# EAGLE design VSR Mini Mega rev 1.206C dual led option (EAGLE 9.6.2)
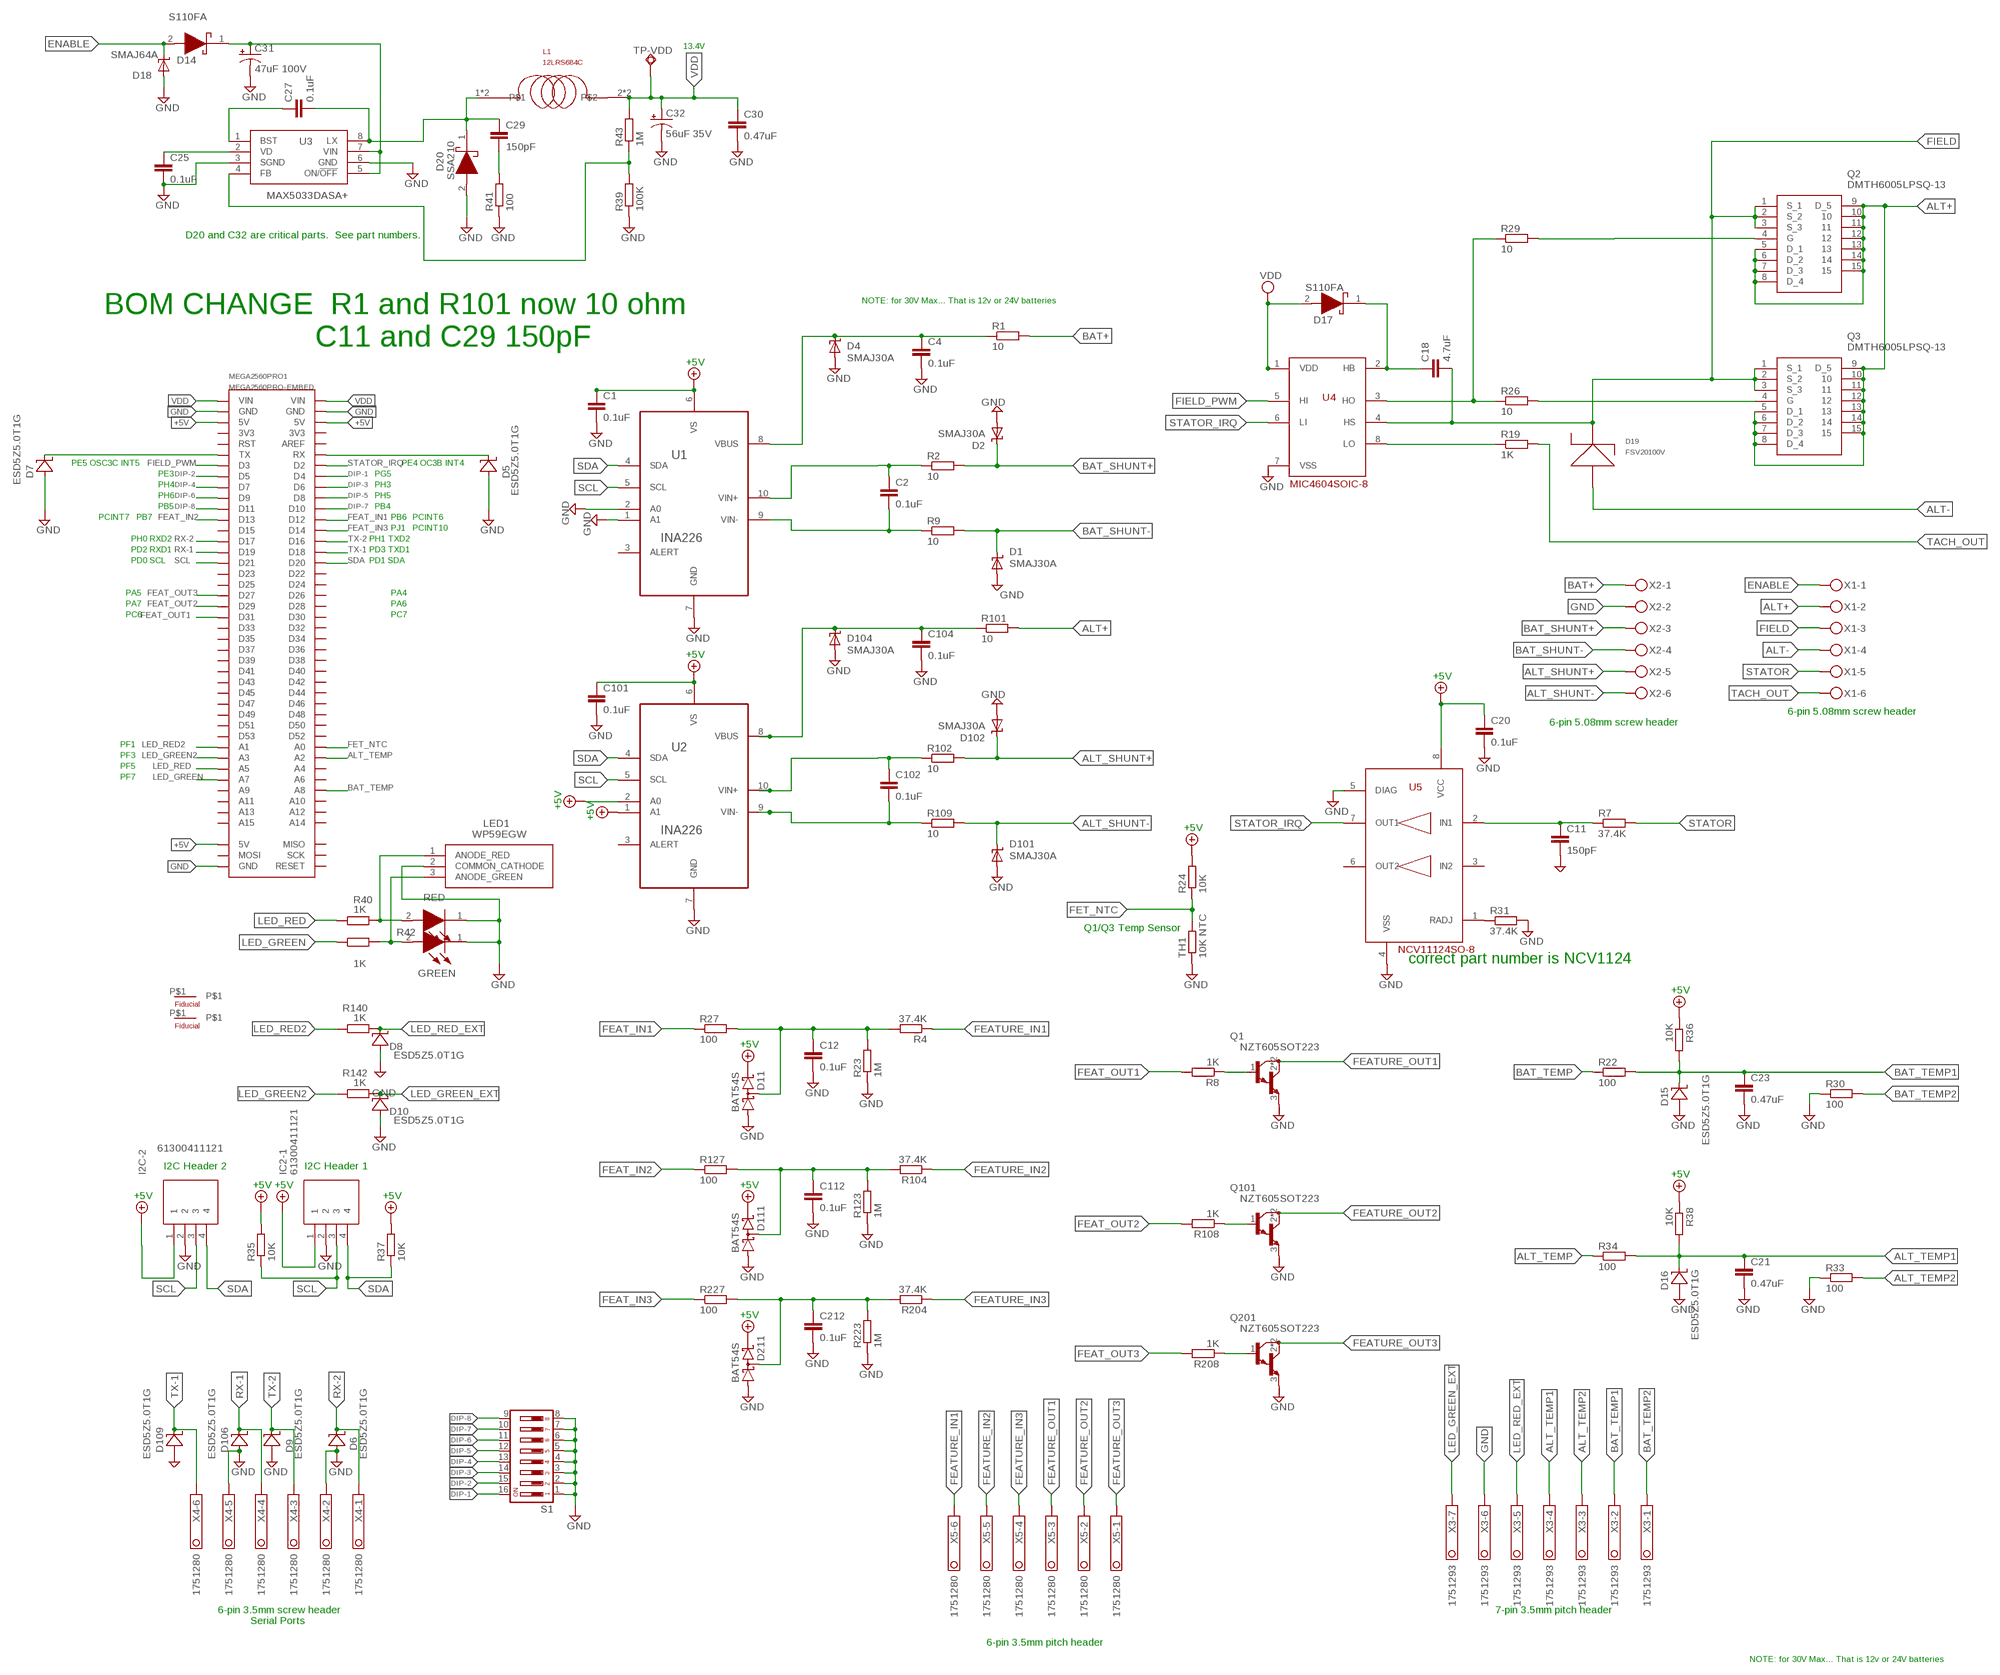
[diagram p0: schematic, sheet 1]

## Parts
C1  0.1uF  C-EUC0603  [C0603]
C2  0.1uF  C-EUC0603  [C0603]
C4  0.1uF  C-EUC0603  [C0603]
C11  150pF  C-EUC0603  [C0603]
C12  0.1uF  C-EUC0603  [C0603]
C18  4.7uF  C-EUC0603K  [C0603K]
C20  0.1uF  C-EUC0603  [C0603]
C21  0.47uF  C-EUC0603  [C0603]
C23  0.47uF  C-EUC0603  [C0603]
C25  0.1uF  C-EUC0603  [C0603]
C27  0.1uF  C-EUC0603  [C0603]
C29  150pF  C-EUC0603  [C0603]
C30  0.47uF  C-EUC0603  [C0603]
C31  47uF 100V  CPOL-USCAPPRD500W60D100H1250B  [CAPPRD500W60D1000H1250B]
C32  56uF 35V  CPOL-US  [CAPPRD250W50D630H1100B]
C101  0.1uF  C-EUC0603  [C0603]
C102  0.1uF  C-EUC0603  [C0603]
C104  0.1uF  C-EUC0603  [C0603]
C112  0.1uF  C-EUC0603  [C0603]
C212  0.1uF  C-EUC0603  [C0603]
D1  SMAJ30A  SUPPRESSOR-SMBJ  [SMBJ]
D2  SMAJ30A  SUPPRESSOR-SMBJ  [SMBJ]
D4  SMAJ30A  SUPPRESSOR-SMBJ  [SMBJ]
D5  ESD5Z5.0T1G  [SOD523]
D6  ESD5Z5.0T1G  [SOD523]
D7  ESD5Z5.0T1G  [SOD523]
D8  ESD5Z5.0T1G  [SOD523]
D9  ESD5Z5.0T1G  [SOD523]
D10  ESD5Z5.0T1G  [SOD523]
D11  BAT54S  [SOT23]
D14  S110FA  [SODFL3618X143N]
D15  ESD5Z5.0T1G  [SOD523]
D16  ESD5Z5.0T1G  [SOD523]
D17  S110FA  [SODFL3618X143N]
D18  SMAJ64A  SUPPRESSOR-SMBJ  [SMBJ]
D19  FSV20100V  [TO-277]
D20  SSA210  [DIOM5227X270N]
D101  SMAJ30A  SUPPRESSOR-SMBJ  [SMBJ]
D102  SMAJ30A  SUPPRESSOR-SMBJ  [SMBJ]
D104  SMAJ30A  SUPPRESSOR-SMBJ  [SMBJ]
D106  ESD5Z5.0T1G  [SOD523]
D109  ESD5Z5.0T1G  [SOD523]
D111  BAT54S  [SOT23]
D211  BAT54S  [SOT23]
FIDUCIAL1  FIDUCIAL060  [FIDUCIAL060]
FIDUCIAL2  FIDUCIAL060  [FIDUCIAL060]
GREEN  599-0110-007F  [LEDM2012X90N]
I2C-2  61300411121  [HDRV4W95P0X254_1X4_1016X254X85]
IC2-1  61300411121  [HDRV4W95P0X254_1X4_1016X254X85]
L1  12LRS684C  [IND_12LRS156C]
LED1  WP59EGW  [T-1_3/4(5MM)_BI-COLOR_INDICATO]
MEGA2560PRO1  MEGA2560PRO-EMBED  [MEGA2560PRO-EMBED]
Q1  NZT605SOT223  [SOT223]
Q2  DMTH6005LPSQ-13  [DMTH6005LPSQ13]
Q3  DMTH6005LPSQ-13  [DMTH6005LPSQ13]
Q101  NZT605SOT223  [SOT223]
Q201  NZT605SOT223  [SOT223]
R1  10  R-EU_R0603  [R0603]
R2  10  R-EU_R0603  [R0603]
R4  37.4K  R-EU_R0603  [R0603]
R7  37.4K  R-EU_R0603  [R0603]
R8  1K  R-EU_R0603  [R0603]
R9  10  R-EU_R0603  [R0603]
R19  1K  R-EU_R0603  [R0603]
R22  100  R-EU_R0603  [R0603]
R23  1M  R-EU_R0603  [R0603]
R24  10K  R-EU_R0603  [R0603]
R26  10  R-EU_R0603  [R0603]
R27  100  R-EU_R0603  [R0603]
R29  10  R-EU_R0603  [R0603]
R30  100  R-EU_R0603  [R0603]
R31  37.4K  R-EU_R0603  [R0603]
R33  100  R-EU_R0603  [R0603]
R34  100  R-EU_R0603  [R0603]
R35  10K  R-EU_R0603  [R0603]
R36  10K  R-EU_R0603  [R0603]
R37  10K  R-EU_R0603  [R0603]
R38  10K  R-EU_R0603  [R0603]
R39  100K  R-EU_R0603  [R0603]
R40  1K  R-EU_R0603  [R0603]
R41  100  R-EU_R0603  [R0603]
R42  1K  R-EU_R0603  [R0603]
R43  1M  R-EU_R0603  [R0603]
R101  10  R-EU_R0603  [R0603]
R102  10  R-EU_R0603  [R0603]
R104  37.4K  R-EU_R0603  [R0603]
R108  1K  R-EU_R0603  [R0603]
R109  10  R-EU_R0603  [R0603]
R123  1M  R-EU_R0603  [R0603]
R127  100  R-EU_R0603  [R0603]
R140  1K  R-EU_R0603  [R0603]
R142  1K  R-EU_R0603  [R0603]
R204  37.4K  R-EU_R0603  [R0603]
R208  1K  R-EU_R0603  [R0603]
R223  1M  R-EU_R0603  [R0603]
R227  100  R-EU_R0603  [R0603]
RED  599-0110-007F  [LEDM2012X90N]
S1  DP08  [DP-08]
TH1  10K NTC  R-EU_R0402  [R0402]
TP-VDD  TPSQTP20SQ  [TP20SQ]
U1  INA226  [SOP50P490X110-10N]
U2  INA226  [SOP50P490X110-10N]
U3  MAX5033DASA+  [SOIC127P600X175-8N]
U4  MIC4604SOIC-8  [SOIC8]
U5  NCV11124SO-8  [SO-8]
X1  MKDSN1,5/6-5,08  [MKDSN1,5/6-5,08]
X2  MKDSN1,5/6-5,08  [MKDSN1,5/6-5,08]
X3  1751293  [1751293]
X4  1751280  [1751280]
X5  1751280  [1751280]

## Nets
+5V: C1.1 C20.1 C101.1 D11.2(C2) D111.2(C2) D211.2(C2) I2C-2.1 IC2-1.1 MEGA2560PRO1.5V@1(5V) MEGA2560PRO1.5V@2(5V) MEGA2560PRO1.5V@3(5V) R24.2 R35.2 R36.1 R37.2 R38.1 U1.6(VS) U2.1(A1) U2.2(A0) U2.6(VS) U5.8(VCC)
ALT+: Q2.5(D_1) Q2.6(D_2) Q2.7(D_3) Q2.8(D_4) Q2.9(D_5) Q2.10 Q2.11 Q2.12 Q2.13 Q2.14 Q2.15 Q3.5(D_1) Q3.6(D_2) Q3.7(D_3) Q3.8(D_4) Q3.9(D_5) Q3.10 Q3.11 Q3.12 Q3.13 Q3.14 Q3.15 R101.2 X1.2
ALT-: D19.1 D19.2 X1.4
ALT_SHUNT+: D102.C R102.2 X2.5
ALT_SHUNT-: D101.C R109.2 X2.6
ALT_TEMP: MEGA2560PRO1.A2 R34.1
ALT_TEMP1: C21.1 D16.C R34.2 R38.2 X3.4
ALT_TEMP2: R33.2 X3.3
BAT+: R1.2 X2.1
BAT_SHUNT+: D2.C R2.2 X2.3
BAT_SHUNT-: D1.C R9.2 X2.4
BAT_TEMP: MEGA2560PRO1.A8 R22.1
BAT_TEMP1: C23.1 D15.C R22.2 R36.2 X3.2
BAT_TEMP2: R30.2 X3.1
D111: C112.1 D111.3(C1A2) R104.2 R123.2 R127.2
DIP-1: MEGA2560PRO1.D4 S1.16
DIP-2: MEGA2560PRO1.D5 S1.15
DIP-3: MEGA2560PRO1.D6 S1.14
DIP-4: MEGA2560PRO1.D7 S1.13
DIP-5: MEGA2560PRO1.D8 S1.12
DIP-6: MEGA2560PRO1.D9 S1.11
DIP-7: MEGA2560PRO1.D10 S1.10
DIP-8: MEGA2560PRO1.D11 S1.9
ENABLE: D14.2(A) D18.C X1.1
FEAT_IN1: MEGA2560PRO1.D12 R27.1
FEAT_IN2: MEGA2560PRO1.D13 R127.1
FEAT_IN3: MEGA2560PRO1.D14 R227.1
FEAT_OUT1: MEGA2560PRO1.D31 R8.2
FEAT_OUT2: MEGA2560PRO1.D29 R108.2
FEAT_OUT3: MEGA2560PRO1.D27 R208.2
FEATURE_IN1: R4.1 X5.6
FEATURE_IN2: R104.1 X5.5
FEATURE_IN3: R204.1 X5.4
FEATURE_OUT1: Q1.2(C) Q1.4(C) X5.3
FEATURE_OUT2: Q101.2(C) Q101.4(C) X5.2
FEATURE_OUT3: Q201.2(C) Q201.4(C) X5.1
FET_NTC: MEGA2560PRO1.A0 R24.1 TH1.2
FIELD: C18.2 D19.3 Q2.1(S_1) Q2.2(S_2) Q2.3(S_3) Q3.1(S_1) Q3.2(S_2) Q3.3(S_3) U4.4(HS) X1.3
FIELD_PWM: MEGA2560PRO1.D3 U4.5(HI)
GND: C1.2 C4.2 C11.2 C12.2 C20.2 C21.2 C23.2 C25.2 C30.2 C31.2(-) C32.2(-) C101.2 C104.2 C112.2 C212.2 D1.A D2.A D4.A D5.A D6.A D7.A D8.A D9.A D10.A D11.1(A1) D15.A D16.A D18.A D20.2(A) D101.A D102.A D104.A D106.A D109.A D111.1(A1) D211.1(A1) GREEN.1(K) I2C-2.2 IC2-1.2 LED1.2(COMMON_CATHODE) MEGA2560PRO1.GND@1(GND) MEGA2560PRO1.GND@2(GND) MEGA2560PRO1.GND@3(GND) Q1.3(E) Q101.3(E) Q201.3(E) R23.1 R30.1 R31.2 R33.1 R39.1 R41.1 R123.1 R223.1 RED.1(K) S1.1 S1.2 S1.3 S1.4 S1.5 S1.6 S1.7 S1.8 TH1.1 U1.1(A1) U1.2(A0) U1.7(GND) U2.7(GND) U3.3(SGND) U3.6(GND) U4.7(VSS) U5.4(VSS) U5.5(DIAG) X2.2 X3.6 X4.2 X4.5
LED_GREEN: MEGA2560PRO1.A7 R42.1
LED_GREEN2: MEGA2560PRO1.A3 R142.1
LED_GREEN_EXT: D10.C R142.2 X3.7
LED_RED: MEGA2560PRO1.A5 R40.1
LED_RED2: MEGA2560PRO1.A1 R140.1
LED_RED_EXT: D8.C R140.2 X3.5
N$1: C102.1 R102.1 U2.10(VIN+)
N$2: C102.2 R109.1 U2.9(VIN-)
N$3: C2.1 R2.1 U1.10(VIN+)
N$4: C2.2 R9.1 U1.9(VIN-)
N$5: C104.1 D104.C R101.1 U2.8(VBUS)
N$6: C18.1 D17.1(K) U4.2(HB)
N$7: C12.1 D11.3(C1A2) R4.2 R23.2 R27.2
N$8: R26.1 R29.1 U4.3(HO)
N$9: C212.1 D211.3(C1A2) R204.2 R223.2 R227.2
N$10: Q1.1(B) R8.1
N$11: Q2.4(G) R29.2
N$12: R19.1 U4.8(LO)
N$13: Q3.4(G) R26.2
N$14: C11.1 R7.1 U5.2(IN1)
N$15: R31.1 U5.1(RADJ)
N$16: Q101.1(B) R108.1
N$17: C4.1 D4.C R1.1 U1.8(VBUS)
N$18: Q201.1(B) R208.1
N$19: C31.1(+) D14.1(K) U3.5(ON/!OFF) U3.7(VIN)
N$20: C25.1 U3.2(VD)
N$21: C27.1 U3.1(BST)
N$22: C27.2 C29.1 D20.1(K) L1.1 L1.4 U3.8(LX)
N$23: D7.C MEGA2560PRO1.TX
N$24: C29.2 R41.2
N$25: LED1.1(ANODE_RED) R40.2 RED.2(A)
N$26: GREEN.2(A) LED1.3(ANODE_GREEN) R42.2
N$27: R39.2 R43.1 U3.4(FB)
N$28: D5.C MEGA2560PRO1.RX
RX-1: D106.C MEGA2560PRO1.D19 X4.4
RX-2: D6.C MEGA2560PRO1.D17 X4.1
SCL: I2C-2.3 IC2-1.3 MEGA2560PRO1.D21 R35.1 U1.5(SCL) U2.5(SCL)
SDA: I2C-2.4 IC2-1.4 MEGA2560PRO1.D20 R37.1 U1.4(SDA) U2.4(SDA)
STATOR: R7.2 X1.5
STATOR_IRQ: MEGA2560PRO1.D2 U4.6(LI) U5.7(OUT1)
TACH_OUT: R19.2 X1.6
TX-1: D109.C MEGA2560PRO1.D18 X4.6
TX-2: D9.C MEGA2560PRO1.D16 X4.3
VDD: C30.1 C32.1(+) D17.2(A) L1.2 L1.3 MEGA2560PRO1.VIN@1(VIN) MEGA2560PRO1.VIN@2(VIN) R43.2 TP-VDD.TP U4.1(VDD)
Unconnected: FIDUCIAL1.P$1 FIDUCIAL2.P$1 MEGA2560PRO1.3V3@1(3V3) MEGA2560PRO1.3V3@2(3V3) MEGA2560PRO1.A4 MEGA2560PRO1.A6 MEGA2560PRO1.A9 MEGA2560PRO1.A10 MEGA2560PRO1.A11 MEGA2560PRO1.A12 MEGA2560PRO1.A13 MEGA2560PRO1.A14 MEGA2560PRO1.A15 MEGA2560PRO1.AREF MEGA2560PRO1.D15 MEGA2560PRO1.D22 MEGA2560PRO1.D23 MEGA2560PRO1.D24 MEGA2560PRO1.D25 MEGA2560PRO1.D26 MEGA2560PRO1.D28 MEGA2560PRO1.D30 MEGA2560PRO1.D32 MEGA2560PRO1.D33 MEGA2560PRO1.D34 MEGA2560PRO1.D35 MEGA2560PRO1.D36 MEGA2560PRO1.D37 MEGA2560PRO1.D38 MEGA2560PRO1.D39 MEGA2560PRO1.D40 MEGA2560PRO1.D41 MEGA2560PRO1.D42 MEGA2560PRO1.D43 MEGA2560PRO1.D44 MEGA2560PRO1.D45 MEGA2560PRO1.D46 MEGA2560PRO1.D47 MEGA2560PRO1.D48 MEGA2560PRO1.D49 MEGA2560PRO1.D50 MEGA2560PRO1.D51 MEGA2560PRO1.D52 MEGA2560PRO1.D53 MEGA2560PRO1.MISO MEGA2560PRO1.MOSI MEGA2560PRO1.RESET MEGA2560PRO1.RST MEGA2560PRO1.SCK U1.3(ALERT) U2.3(ALERT) U5.3(IN2) U5.6(OUT2)

## Notes on the sheet
- 13.4V
- D20 and C32 are critical parts.  See part numbers.
- NOTE: for 30V Max... That is 12v or 24V batteries
- BOM CHANGE  R1 and R101 now 10 ohm
- C11 and C29 150pF
- PE5 OSC3C INT5 | PE4 OC3B INT4
- PE3 | PG5
- PH4 | PH3
- PH6 | PH5
- PB5 | PB4
- PCINT7 | PB7 | PB6 | PCINT6
- PJ1 | PCINT10
- PH0 RXD2 | PH1 TXD2
- PD2 RXD1 | PD3 TXD1
- PD0 SCL | PD1 SDA
- PA5 | PA4
- PA7 | PA6
- PC6 | PC7
- 6-pin 5.08mm screw header
- 6-pin 5.08mm screw header
- PF1
- PF3
- PF5
- PF7
- Q1/Q3 Temp Sensor
- correct part number is NCV1124
- I2C Header 2 | I2C Header 1
- 6-pin 3.5mm screw header | 7-pin 3.5mm pitch header
- Serial Ports
- 6-pin 3.5mm pitch header
- NOTE: for 30V Max... That is 12v or 24V batteries

## Library data of the parts
C1 C2 C4 C11 C12 C18 C20 C21 C23 C25 C27 C29 C30 C101 C102 C104 C112 C212 = rcl:C-EU: CAPACITOR, European symbol; SPICEPREFIX: C
C31 C32 = DublerCustomParts:CPOL-US: POLARIZED CAPACITOR, American symbol
D1 D2 D4 D18 D101 D102 D104 = diode:SUPPRESSOR-: Suppressor diode
D5-D10 D15 D16 D106 D109 = DublerCustomParts:ESD5Z5.0T1G
D11 D111 D211 = diode:BAT54S: Schottky Diodes Pin connection corrected 2011-05-04 Source: Fairchild .. BAT54.pdf
D14 D17 = SamacSys_Parts:S110FA: Schottky Diodes & Rectifiers 100V 1A Schottky Barrier Rectifier Source: Datasheet <https://componentsearchengine.com/Datasheets/1/S110FA.pdf>; DESCRIPTION: Schottky Diodes & Rectifiers 100V 1A Schottky Barrier Rectifier; HEIGHT: 1.43mm; MANUFACTURER_NAME: ON Semiconductor; MANUFACTURER_PART_NUMBER: S110FA; MOUSER_PART_NUMBER: 512-S110FA; MOUSER_PRICE-STOCK: https://www.mouser.com/Search/Refine.aspx?Keyword=512-S110FA
D19 = DublerCustomParts:FSV20100V: Diode Schottky 100V 20A Surface Mount TO-277-3 Check prices <https://pricing.snapeda.com/parts/FSV20100V/ON%20Semiconductor/view-part?ref=eda>; AVAILABILITY: Good; DESCRIPTION: Diode Schottky 100V 20A Surface Mount TO-277-3; MF: ON Semiconductor; MP: FSV20100V; PACKAGE: TO-277-3 ON Semiconductor; PRICE: None; PURCHASE-URL: https://pricing.snapeda.com/search/part/FSV20100V/?ref=eda
D20 = SamacSys_Parts:SSA210: Diode Schottky 100V 2A 2-Pin SMA T/R Source: Datasheet <https://www.onsemi.com/pub/Collateral/SSA210-D.pdf>; DESCRIPTION: Diode Schottky 100V 2A 2-Pin SMA T/R; HEIGHT: 2.7mm; MANUFACTURER_NAME: ON Semiconductor; MANUFACTURER_PART_NUMBER: SSA210; MOUSER_PART_NUMBER: 512-SSA210; MOUSER_PRICE-STOCK: https://www.mouser.co.uk/ProductDetail/ON-Semiconductor-Fairchild/SSA210/?qs=tqW9UTzndZw5aU%2F0PcUcNQ%3D%3D
FIDUCIAL1 FIDUCIAL2 = pads:FIDUCIAL060
GREEN RED = SamacSys_Parts:599-0110-007F: Standard LEDs - SMD SMD 0805 RED Source: Datasheet; DESCRIPTION: Standard LEDs - SMD SMD 0805 RED; HEIGHT: 0.9mm; MANUFACTURER_NAME: Dialight; MANUFACTURER_PART_NUMBER: 599-0110-007F; MOUSER_PART_NUMBER: 645-599-0110-007F; MOUSER_PRICE-STOCK: https://www.mouser.co.uk/ProductDetail/Dialight/599-0110-007F?qs=gTYE2QTfZfS0HtheKY0LlQ%3D%3D
I2C-2 IC2-1 = SamacSys_Parts:61300411121: WR-PHD 2.54mm Pin Header THT Straight 4p Wurth Elektronik WR-PHD Series, Series Number 6130, 2.54mm Pitch 4 Way 1 Row Straight PCB Header, Solder Termination Source: Datasheet <http://katalog.we-online.de/em/datasheet/6130xx11121.pdf>; DESCRIPTION: WR-PHD 2.54mm Pin Header THT Straight 4p Wurth Elektronik WR-PHD Series, Series Number 6130, 2.54mm Pitch 4 Way 1 Row Straight PCB Header, Solder Termination; HEIGHT: 8.54mm; MANUFACTURER_NAME: Wurth Elektronik; MANUFACTURER_PART_NUMBER: 61300411121; MOUSER_PART_NUMBER: 710-61300411121; MOUSER_PRICE-STOCK: https://www.mouser.co.uk/ProductDetail/Wurth-Elektronik/61300411121/?qs=PhR8RmCirEYQcLLqXD8rAA%3D%3D
L1 = DublerCustomParts:12LRS684C
LED1 = SamacSys_Parts:WP59EGW: 5MM BI-COLOR RED/GRN LED LAMP THOLE BULK Kingbright WP59EGW, WP Series Green, Red LED, 568 / 617 nm 3-Pin 5mm (T-1 3/4) Diffused, Dome Lens Through Hole package Source: Datasheet <http://www.us.kingbright.com/images/catalog/SPEC/WP59EGW.pdf>; DESCRIPTION: 5MM BI-COLOR RED/GRN LED LAMP THOLE BULK Kingbright WP59EGW, WP Series Green, Red LED, 568 / 617 nm 3-Pin 5mm (T-1 3/4) Diffused, Dome Lens Through Hole package; HEIGHT: mm; MANUFACTURER_NAME: Kingbright; MANUFACTURER_PART_NUMBER: WP59EGW; MOUSER_PART_NUMBER: 604-WP59EGW; MOUSER_PRICE-STOCK: https://www.mouser.co.uk/ProductDetail/Kingbright/WP59EGW/?qs=7T7YwZBtMHSEJxkhdk2k2w%3D%3D
MEGA2560PRO1 = MINI MEGA PRO EAGLE robotdyn:MEGA2560PRO-EMBED: Robotdyn Robotdyn Mega 2560 PRO (Embed) https://robotdyn.com/mega-2560-pro-embed-ch340g-atmega2560-16au.html
Q1 Q101 Q201 = DublerCustomParts:NZT605: NPN Darlington Transistor
Q2 Q3 = SamacSys_Parts:DMTH6005LPSQ-13: Trans MOSFET N-CH 60V 20.6A Automotive 8-Pin PowerDI 5060 T/R Source: Datasheet; DESCRIPTION: Trans MOSFET N-CH 60V 20.6A Automotive 8-Pin PowerDI 5060 T/R; HEIGHT: 2mm; MANUFACTURER_NAME: Diodes Inc.; MANUFACTURER_PART_NUMBER: DMTH6005LPSQ-13; MOUSER_PART_NUMBER: 621-DMTH6005LPSQ-13; MOUSER_PRICE-STOCK: https://www.mouser.co.uk/ProductDetail/Diodes-Incorporated/DMTH6005LPSQ-13?qs=icAhCOE9Tbg2WunJgzUq9Q%3D%3D
R1 R2 R4 R7-R9 R19 R22-R24 R26 R27 R29-R31 R33-R43 R101 R102 R104 R108 R109 R123 R127 R140 R142 R204 R208 R223 R227 TH1 = rcl:R-EU_: RESISTOR, European symbol; SPICEPREFIX: R
S1 = switch-dil:DP08: DIL/CODE SWITCH; MPN: DP08; OC_FARNELL: 9471626; OC_NEWARK: 73J0035
TP-VDD = testpad:TPSQ
U1 U2 = DublerCustomParts:INA226: CURRENT/POWER MONITOR with Two-Wire Interface; MOUSER: 595-INA226AIDGSR; MPN: INA226AIDGSR; PACKAGE: MSOP-10; SUPPLIER: Texas Instruments
U3 = SamacSys_Parts:MAX5033DASA+: DC-DC Converter Step Down 7.5V to 76V Source: Datasheet <http://datasheets.maximintegrated.com/en/ds/MAX5033.pdf>; DESCRIPTION: DC-DC Converter Step Down 7.5V to 76V; HEIGHT: 1.75mm; MANUFACTURER_NAME: Maxim Integrated; MANUFACTURER_PART_NUMBER: MAX5033DASA+; MOUSER_PART_NUMBER: 700-MAX5033DASA; MOUSER_PRICE-STOCK: https://www.mouser.com/Search/Refine.aspx?Keyword=700-MAX5033DASA
U4 = DublerCustomParts:MIC4604
U5 = DublerCustomParts:NCV11124
X1 X2 = con-phoenix-508:MKDSN1,5/6-5,08: MKDSN 1,5/ 6-5,08 Printklemme Nennstrom: 13,5 A Nennspannung: 250 V Rastermaß: 5,08 mm Polzahl: 6 Anschlussart: Schraubanschluss Montage: Löten Anschlussrichtung Leiter/Platine: 0 ° Artikelnummer: 1729160 Source: http://eshop.phoenixcontact.com .. 1729160.pdf
X3 = con-phoenix-350:1751293: MKDS 1/ 7-3,5 Printklemme Nennstrom: 10 A Bemessungsspannung: 160 V Raster: 3,5 mm Polzahl: 7 Montageart: Löten Anschlussart: Schraubanschluss Anschlussrichtung vom Leiter zur Platine: 0° Source: http://eshop.phoenixcontact.com .. 1751293.pdf; OC_FARNELL: unknown; OC_NEWARK: unknown
X4 X5 = con-phoenix-350:1751280: MKDS 1/ 6-3,5 Printklemme Nennstrom: 10 A Bemessungsspannung: 160 V Raster: 3,5 mm Polzahl: 6 Montageart: Löten Anschlussart: Schraubanschluss Anschlussrichtung vom Leiter zur Platine: 0° Source: http://eshop.phoenixcontact.com .. 1751280.pdf; MPN: 1751280; OC_FARNELL: unknown; OC_NEWARK: 27R1765

## Board
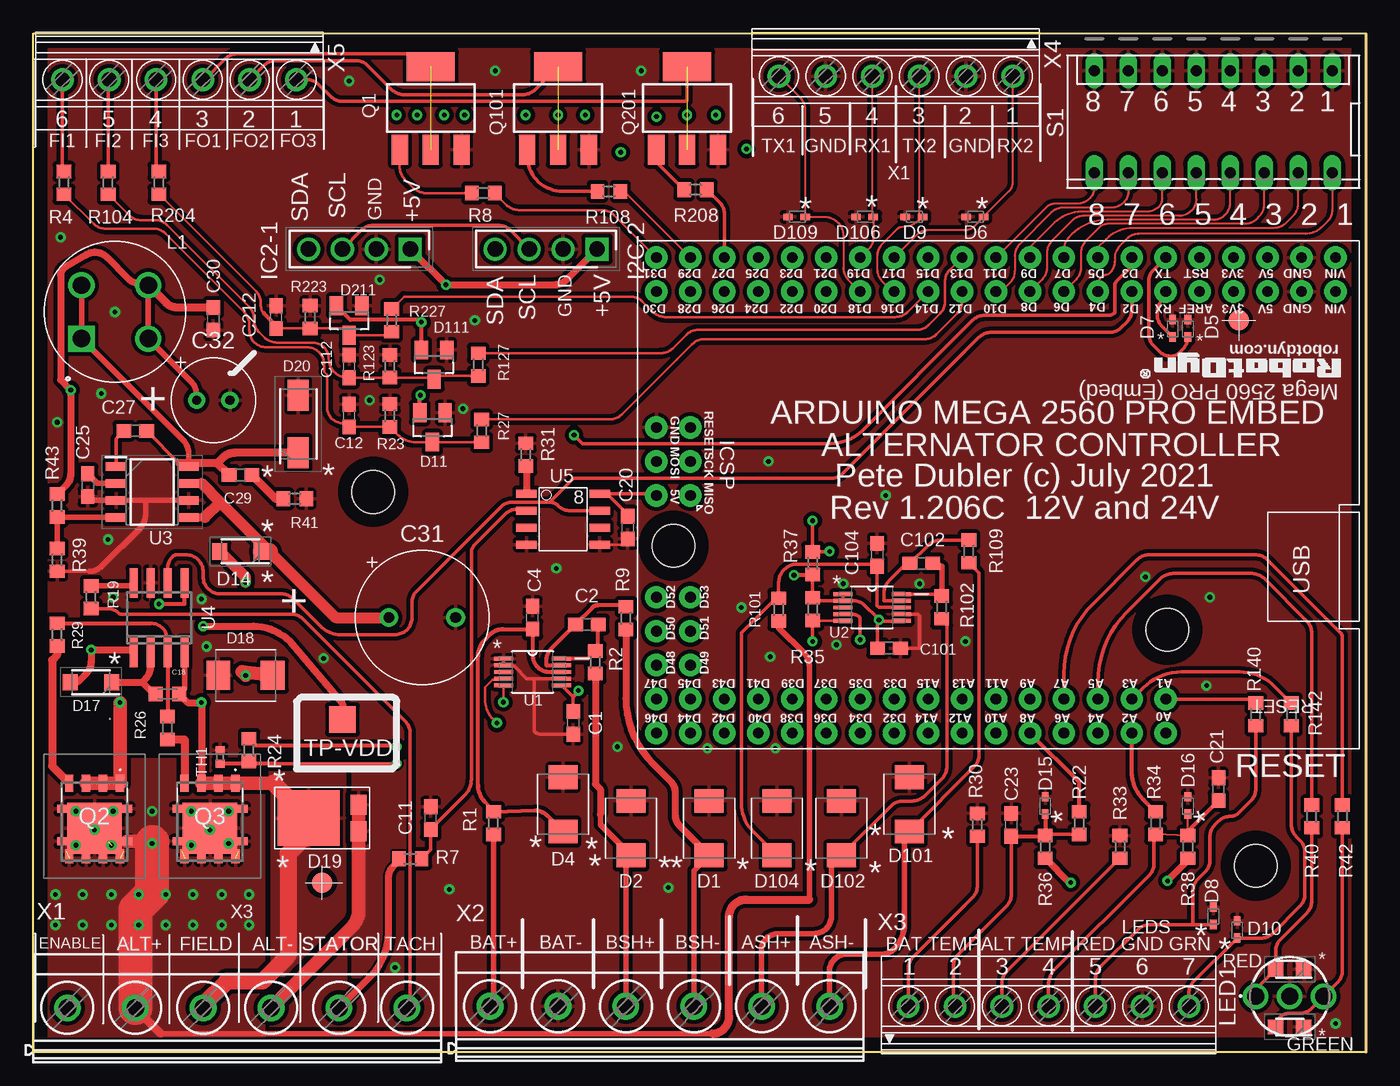
[diagram p1: board, top side]
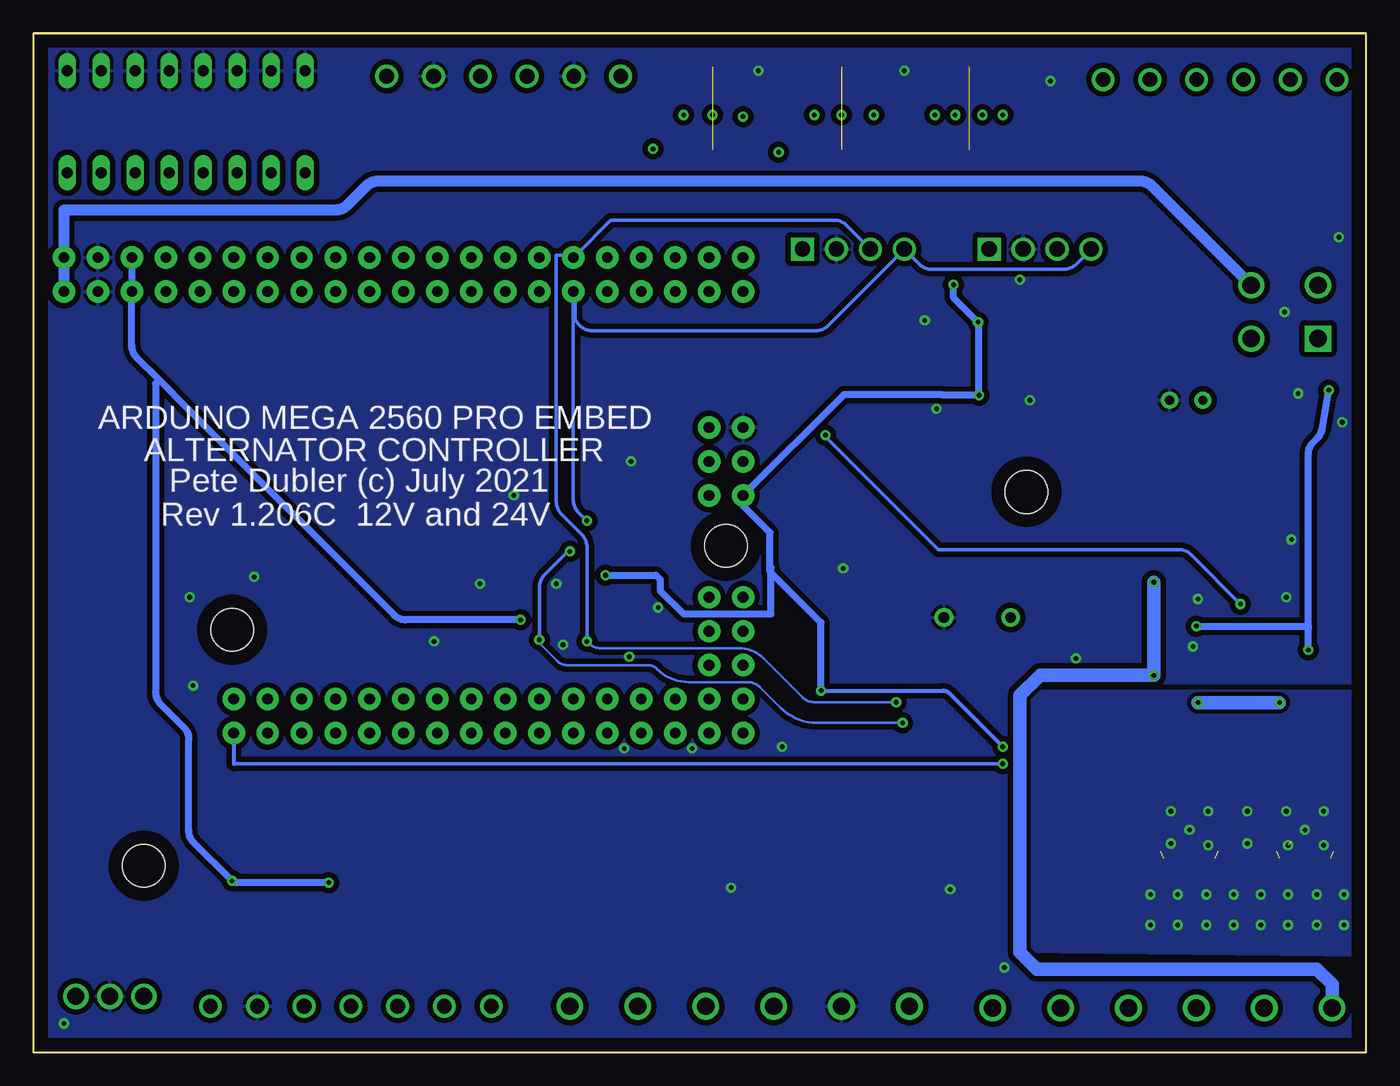
[diagram p2: board, bottom side, seen from below]

Size 99.69 x 76.2 mm. Coordinates in mm from the lower left corner, seen from the top.
Outline: 0,0 99.62,0 99.62,76.19 0,76.19
Outline: 0,0 0,76.2 99.69,76.2 99.69,0 0,0
Copper layers (1*16): Top 0.035mm / dielectric 1.5mm / Bottom 0.035mm
Design rules "default *": minimum track width 6mil, minimum drill 0.3mm, track to track 6mil, track to pad 6mil, pad to pad 6mil, via to via 6mil, smd to smd 6mil, copper to edge 40mil, drill to drill 6mil, minimum pad ring 10mil, minimum via ring 8mil, stop-mask expansion 4mil, vias tented up to drill 0mil, thermal gap 10mil
Holes 3.2 mm at 25.4,41.91 91.44,13.97

### Footprints (pad centres in the part's own frame; a part is rotated, then mirrored left to right if it is on the bottom)
C0603 = smd 1.1 x 1: 1 -0.85,0; 2 0.85,0
C0603K = smd 1.05 x 1.08: 1 -0.875,0; 2 0.875,0
CAPPRD500W60D1000H1250B = drill 0.8 pad 1.4: 1 -2.5,0; 2 2.5,0
CAPPRD250W50D630H1100B = drill 0.7 pad 1.3: 1 -1.25,0; 2 1.25,0
SMBJ = smd 1.78 x 2.16: A 2.04,0; C -2.03,0
SOD523 = smd 0.7 x 0.5: A 0.7,0; C -0.6,0
SOT23 = smd 1 x 1.4: 1 -0.95,-1.1; 2 0.95,-1.1; 3 0,1.1
SODFL3618X143N = smd 1.12 x 1.22: 1 -1.55,0; 2 1.55,0
TO-277 = smd 1.2 x 1.5: 1 2.75,0.985; 2 2.75,-0.985 | smd 4.65 x 4.15: 3 -1,0
DIOM5227X270N = smd 2.35 x 1.55: 1 -2.15,0; 2 2.15,0
FIDUCIAL060 = smd 1.524 x 1.524: P$1 0,0
LEDM2012X90N = smd 1.15 x 1.1: 1 -1.05,0; 2 1.05,0
HDRV4W95P0X254_1X4_1016X254X85 = drill 1.15 pad 1.725 square: 1 0,0 | drill 1.15 pad 1.725: 2 2.54,0; 3 5.08,0; 4 7.62,0
IND_12LRS156C = drill 1.3 square: 1 -2,2.5 | drill 1.3: 2 -2,-2.5; 3 2,-2.5; 4 2,2.5
T-1_3/4(5MM)_BI-COLOR_INDICATO = drill 1.26 pad 1.9: 1 0,2.54; 2 0,0; 3 0,-2.54
MEGA2560PRO-EMBED = drill 0.8 pad 1.676: 3V3@1 -25.4,-19.05; 3V3@2 -25.4,-16.51; 5V@1 -27.94,-19.05; 5V@2 -27.94,-16.51; 5V@3 17.78,-1.27; A0 -20.32,16.51; A1 -20.32,13.97; A2 -17.78,16.51; A3 -17.78,13.97; A4 -15.24,16.51; A5 -15.24,13.97; A6 -12.7,16.51; A7 -12.7,13.97; A8 -10.16,16.51; A9 -10.16,13.97; A10 -7.62,16.51; A11 -7.62,13.97; A12 -5.08,16.51; A13 -5.08,13.97; A14 -2.54,16.51; A15 -2.54,13.97; AREF -22.86,-16.51; D2 -17.78,-16.51; D3 -17.78,-19.05; D4 -15.24,-16.51; D5 -15.24,-19.05; D6 -12.7,-16.51; D7 -12.7,-19.05; D8 -10.16,-16.51; D9 -10.16,-19.05; D10 -7.62,-16.51; D11 -7.62,-19.05; D12 -5.08,-16.51; D13 -5.08,-19.05; D14 -2.54,-16.51; D15 -2.54,-19.05; D16 0,-16.51; D17 0,-19.05; D18 2.54,-16.51; D19 2.54,-19.05; D20 5.08,-16.51; D21 5.08,-19.05; D22 7.62,-16.51; D23 7.62,-19.05; D24 10.16,-16.51; D25 10.16,-19.05; D26 12.7,-16.51; D27 12.7,-19.05; D28 15.24,-16.51; D29 15.24,-19.05; D30 17.78,-16.51; D31 17.78,-19.05; D32 0,16.51; D33 0,13.97; D34 2.54,16.51; D35 2.54,13.97; D36 5.08,16.51; D37 5.08,13.97; D38 7.62,16.51; D39 7.62,13.97; D40 10.16,16.51; D41 10.16,13.97; D42 12.7,16.51; D43 12.7,13.97; D44 15.24,16.51; D45 15.24,13.97; D46 17.78,16.51; D47 17.78,13.97; D48 17.78,11.43; D49 15.24,11.43; D50 17.78,8.89; D51 15.24,8.89; D52 17.78,6.35; D53 15.24,6.35; GND@1 -30.48,-19.05; GND@2 -30.48,-16.51; GND@3 17.78,-6.35; MISO 15.24,-1.27; MOSI 17.78,-3.81; RESET 15.24,-6.35; RST -22.86,-19.05; RX -20.32,-16.51; SCK 15.24,-3.81; TX -20.32,-19.05; VIN@1 -33.02,-19.05; VIN@2 -33.02,-16.51 | hole 3.2: 16.51,2.489; -20.447,8.788
SOT223 = smd 1.219 x 2.235: 1 -2.311,-3.099; 2 0,-3.099; 3 2.311,-3.099 | smd 3.6 x 2.2: 4 0,3.099
DMTH6005LPSQ13 = smd 0.61 x 1.27: 1 -1.904,-2.485; 2 -0.634,-2.485; 3 0.636,-2.485; 4 1.906,-2.485 | smd 0.61 x 0.71: 5 1.906,3.136; 6 0.636,3.136; 7 -0.634,3.136; 8 -1.904,3.136 | smd 4.1 x 3.81: 9 0.001,0.875 | smd 0.75 x 0.6: 10 2.428,1.875; 11 -2.427,1.875; 12 -2.427,-0.55; 13 2.428,-0.55 | smd 0.16 x 0.31: 14 -2.129,2.626; 15 2.131,2.626
R0603 = smd 1 x 1.1: 1 -0.85,0; 2 0.85,0
DP-08 = drill 0.813 long: 1 -8.89,-3.81; 2 -6.35,-3.81; 3 -3.81,-3.81; 4 -1.27,-3.81; 5 1.27,-3.81; 6 3.81,-3.81; 7 6.35,-3.81; 8 8.89,-3.81; 9 8.89,3.81; 10 6.35,3.81; 11 3.81,3.81; 12 1.27,3.81; 13 -1.27,3.81; 14 -3.81,3.81; 15 -6.35,3.81; 16 -8.89,3.81
R0402 = smd 0.6 x 0.7: 1 -0.5,0; 2 0.5,0
TP20SQ = smd 2 x 2: TP 0,0
SOP50P490X110-10N = smd 1.422 x 0.279: 1 -2.184,0.991; 2 -2.184,0.508; 3 -2.184,0; 4 -2.184,-0.508; 5 -2.184,-0.991; 6 2.184,-0.991; 7 2.184,-0.508; 8 2.184,0; 9 2.184,0.508; 10 2.184,0.991
SOIC127P600X175-8N = smd 1.525 x 0.65: 1 -2.712,1.905; 2 -2.712,0.635; 3 -2.712,-0.635; 4 -2.712,-1.905; 5 2.712,-1.905; 6 2.712,-0.635; 7 2.712,0.635; 8 2.712,1.905
SOIC8 = smd 0.6 x 2.2: 1 -1.905,-2.6; 2 -0.635,-2.6; 3 0.635,-2.6; 4 1.905,-2.6; 5 1.905,2.6; 6 0.635,2.6; 7 -0.635,2.6; 8 -1.905,2.6
SO-8 = smd 1.524 x 0.61: 1 -2.743,1.905; 2 -2.743,0.635; 3 -2.743,-0.635; 4 -2.743,-1.905; 5 2.743,-1.905; 6 2.743,-0.635; 7 2.743,0.635; 8 2.743,1.905
MKDSN1,5/6-5,08 = drill 1.3 pad 2: 1 -12.7,0.025; 2 -7.62,0.025; 3 -2.54,0.025; 4 2.54,0.025; 5 7.62,0.025; 6 12.7,0.025
1751293 = drill 1.1 pad 1.7: 1 -10.5,-0.1; 2 -7,-0.1; 3 -3.5,-0.1; 4 0,-0.1; 5 3.5,-0.1; 6 7,-0.1; 7 10.5,-0.1
1751280 = drill 1.1 pad 1.7: 1 -8.75,-0.1; 2 -5.25,-0.1; 3 -1.75,-0.1; 4 1.75,-0.1; 5 5.25,-0.1; 6 8.75,-0.1

### Placement (x,y rotation side)
C1  40.39,24.64 270 top
C2  41.4,32 180 top
C4  37.34,32.51 90 top
C11  29.72,17.53 90 top
C12  23.62,47.62 90 top
C18  10.02,26.8 0 top
C20  44.45,39.24 270 top
C21  88.65,19.68 90 top
C23  73.15,17.02 90 top
C25  4.06,42.42 270 top
C27  7.62,46.48 0 top
C29  15.49,43.18 0 top
C30  13.46,54.86 270 top
C31  29.08,32.51 0 top
C32  13.46,48.77 0 top
C101  64.01,30.23 0 top
C102  66.42,36.58 180 top
C104  63.12,37.21 90 top
C112  23.62,51.31 90 top
C212  18.16,54.99 90 top
D1  50.55,16.76 90 top
D2  44.7,16.76 90 top
D4  39.62,18.54 90 top
D5  85.22,54.1 90 top
D6  70.48,62.48 180 top
D7  86.36,54.1 90 top
D8  88.27,10.16 90 top
D9  65.91,62.48 180 top
D10  90.04,9.14 90 top
D11  29.84,46.74 180 top
D14  15.49,37.47 180 top
D15  75.69,18.41 90 top
D16  86.36,18.41 90 top
D17  4.32,27.69 180 top
D18  15.88,28.19 180 top
D19  21.59,17.53 0 top
D20  19.81,46.99 90 top
D101  65.53,18.54 90 top
D102  60.45,16.76 90 top
D104  55.63,16.76 90 top
D106  62.23,62.48 180 top
D109  57.15,62.48 180 top
D111  29.97,51.44 180 top
D211  23.62,54.74 180 top
FIDUCIAL1  90.17,54.74 0 top
FIDUCIAL2  21.59,12.7 90 top
GREEN  93.98,1.91 180 top
I2C-2  42.16,60.07 180 top
IC2-1  28.19,60.07 180 top
L1  6.1,55.37 90 top
LED1  93.98,4.19 90 top
MEGA2560PRO1  64.39,40.39 180 top
Q1  29.72,70.61 0 top
Q2  4.57,17.65 180 top
Q3  13.21,17.65 180 top
Q101  39.24,70.61 0 top
Q201  48.9,70.61 0 top
R1  34.42,17.14 270 top
R2  42.04,29.17 270 top
R4  2.29,65.02 270 top
R7  28.19,14.48 180 top
R8  33.66,64.26 0 top
R9  44.32,32.47 270 top
R19  4.32,34.04 270 top
R22  78.23,17.14 270 top
R23  26.67,47.62 270 top
R24  16.13,22.61 90 top
R26  10.03,24.26 270 top
R27  33.53,46.48 270 top
R29  1.78,31.24 270 top
R30  70.61,17.02 270 top
R31  36.83,44.7 90 top
R33  81.28,15.37 270 top
R34  83.95,17.14 270 top
R35  58.29,33.15 90 top
R36  75.69,15.37 90 top
R37  58.29,36.58 270 top
R38  86.36,15.37 90 top
R39  1.78,36.83 90 top
R40  95.63,17.65 270 top
R41  19.56,41.4 180 top
R42  97.92,17.65 270 top
R43  1.78,40.89 90 top
R101  55.75,33.11 270 top
R102  67.94,33.27 270 top
R104  5.59,65.02 270 top
R108  43.05,64.39 0 top
R109  69.98,37.47 270 top
R123  26.67,51.31 270 top
R127  33.27,51.44 270 top
R140  91.44,25.27 270 top
R142  94.11,25.27 270 top
R204  9.4,65.02 270 top
R208  49.53,64.52 0 top
R223  20.7,54.99 270 top
R227  26.8,54.74 270 top
RED  93.98,6.22 180 top
S1  88.27,69.6 180 top
TH1  13.97,22.1 270 top
TP-VDD  23.11,24.89 0 top
U1  37.34,28.45 0 top
U2  62.74,33.27 0 top
U3  8.89,41.91 0 top
U4  9.4,32.51 0 top
U5  39.62,39.88 0 top
X1  15.24,3.3 0 top
X2  46.86,3.43 0 top
X3  75.95,3.56 0 top
X4  64.52,72.9 180 top
X5  10.92,72.64 180 top

### Tracks (layer width: path | path; a pad name or v marks a point on that pad's centre or on a via)
+5V  (via drill 0.35)
  Top 0.254: U2.2 58.51,33.78 R35.2 R37.2 | U2.2 61.32,33.78 arc-45 62.22,33.41 63.06,32.58 | 63.06,32.58 63.25,32.38 63.37,32.26 64.9,32.26 U2.6 | U1.6 40.39,26.59 C1.1 | U2.2 U2.1 | C101.1 63.16,32.26 63.16,32.47 63.06,32.58 | U5.8 42.93,41.78 | 42.93,41.78 46.48,41.78 MEGA2560PRO1.5V@3 | C20.1 44.45,40.26 42.93,41.78
  Top 0.305: D111.2 v29.02,54.61 28.85,54.78 23.7,54.78 22.67,55.81 D211.2 | D11.2 28.89,49.09 v28.96,49.15 | 63.25,32.38 v63.25,32.35 63.16,32.26 | 77.51,12.7 v77.6,12.7 | 86.36,14.35 R38.1 | 40.39,26.59 40.77,26.98 v40.77,27.05 | v27.18,22.86 27.09,22.95 16.64,22.95 R24.2 | R37.2 58.25,35.69 v56.9,35.69
  Top 0.508: R36.1 77.51,12.7 | v84.84,12.83 86.36,14.35 | IC2-1.1 v30.86,57.4 38.97,57.4 arc45 39.87,57.78 I2C-2.1
  Bottom 0.305: 28.96,54.48 29.08,54.61 v29.02,54.61 | 31.67,49.15 31.72,49.2 | 92.33,57.4 MEGA2560PRO1.5V@2 | 84.84,12.7 v84.84,12.83 | v40.77,27.05 31.64,27.05 arc45 31.18,26.86 v27.18,22.86
  Bottom 0.508: 28.96,54.48 v28.96,49.15 31.67,49.15 | 31.72,49.2 39.07,49.2 MEGA2560PRO1.5V@3 46.61,40.89 44.58,38.86 44.58,36.32 | v63.25,32.35 71.83,32.35 arc45 72.72,32.72 88.08,48.07 90.3,50.29 | 90.3,50.29 91.96,51.95 arc45 92.33,52.85 MEGA2560PRO1.5V@2 | MEGA2560PRO1.5V@1 92.33,57.4 | v77.6,12.7 84.84,12.7 | v84.84,12.83 87.7,15.69 arc45 88.08,16.59 88.08,23.41 arc-45 88.45,24.31 90.18,26.04 arc45 90.55,26.94 90.55,50.04 90.3,50.29 | v40.77,27.05 40.77,32.13 44.58,35.94 44.58,36.32 | v56.9,35.69 53.12,35.69 52.81,35.37 52.81,34.54 51.06,32.79 44.51,32.79 44.51,36.26 44.58,36.32 | v29.02,54.61 30.86,56.45 v30.86,57.4 | v30.86,57.4 30.86,57.53 v30.86,57.4
ALT+  (via drill 0.35)  (5 unrouted)
  Top 0.305: 56.01,32.16 R101.2
  Top 0.406: 9.54,1.4 50.77,1.4 | 58.04,11.43 58.04,28.94 arc45 57.67,29.84 55.75,31.75 R101.2
  Top 0.61: 9.54,1.4 arc-45 9.51,1.41 7.62,3.3 | 5.59,15.75 5.33,16 | 58.04,11.43 53.31,11.43 arc90 52.05,10.16 52.05,2.67 arc-90 50.77,1.4
  Top 1.016: 8.92,15.78 8.89,15.75 8.86,15.78 Q2.11
  Top 2.54: 8.89,15.75 8.89,11.94 7.62,10.67 7.62,3.3
  other vias: 4.57,16.64 3.17,18.03 3.17,15.49 5.84,15.49 5.97,18.03 11.81,15.49 11.81,18.03 13.21,16.64 14.61,18.03 14.61,15.62 8.89,18.03 8.89,15.62 1.65,11.81 1.65,9.53 3.68,11.81 3.68,9.53 5.84,11.81 5.84,9.53 7.87,11.81 7.87,9.53 9.91,11.81 9.91,9.53 11.94,11.81 11.94,9.53 14.1,11.81 14.1,9.53 16.13,11.81 16.13,9.53
  pour Bottom (isolate 0.305, rank 2): -0.25,27.05 26.29,27.05 26.29,7.53 -0.25,7.22
  pour Top (isolate 0.305, rank 2): -1.4,-0.64 -1.4,21.97 17.27,21.97 17.27,-0.64
ALT-
  Top 1.016: D19.1 D19.2 24.34,10.66 arc-45 23.8,9.34 X1.4
  pour Top: 23.88,21.84 28.45,21.84 28.45,5.59 23.88,5.59
ALT_SHUNT+
  Top 0.152: 60.32,14.61 D102.C
  Top 0.254: D102.C 64.14,18.42 arc-45 65.04,18.8 65.75,18.8 arc45 66.65,19.17 67.95,20.47 arc45 68.33,21.37 68.33,32.04 R102.2
  Top 0.406: 60.32,14.61 59.94,14.99 59.69,14.73 59.69,10.16 arc-90 58.42,8.89 55.73,8.89 arc90 54.46,7.62 54.46,3.48 X2.5
ALT_SHUNT-
  Top 0.203: 65.53,16.13 65.15,15.75
  Top 0.254: D101.C 70.37,21.35 arc45 70.74,22.25 70.74,35.85 R109.2
  Top 0.406: 65.15,15.75 65.15,9.57 arc-45 64.4,7.76 64.36,7.72 arc-45 63.46,7.35 60.83,7.35 arc45 59.93,6.97 59.91,6.96 arc45 59.54,6.06 59.54,3.48 X2.6 | D101.C 65.53,16.13
ALT_TEMP
  Top 0.305: R34.1 83.05,18.89 arc-45 82.17,21.02 MEGA2560PRO1.A2
ALT_TEMP1
  Top 0.152: R34.2 R38.2 86.36,16.26 D16.C
  Top 0.254: R34.2 83.82,16.17 83.82,14.12 arc-45 83.45,13.22 76.32,6.09 arc45 75.95,5.19 X3.4
  Top 0.305: C21.1 86.36,16.55 R38.2
ALT_TEMP2
  Top 0.254: R33.2 72.82,6.05 arc45 72.45,5.16 X3.3
BAT+
  Top 0.406: R1.2 34.42,3.71 X2.1
BAT_SHUNT+
  Top 0.406: 42.42,17.8 42.42,17.02 D2.C 44.32,14.35 X2.3
  Top 0.508: R2.2 42.04,20.07 42.42,19.68 42.42,17.8
BAT_SHUNT-
  Top 0.406: D1.C 49.4,13.59 X2.4
  Top 0.508: R9.2 44.32,26.48 arc45 46.35,21.6 47.63,20.31 arc-45 48.01,19.41 48.01,17.8 arc45 48.38,16.9 D1.C
BAT_TEMP
  Top 0.305: R22.1 78.23,20.19 MEGA2560PRO1.A8
BAT_TEMP1
  Top 0.254: R22.2 75.82,16.3 75.69,16.17 | C23.1 73.15,11.83 arc-45 72.78,10.93 69.21,7.36 arc45 68.83,6.46 68.83,3.57 X3.2
  Top 0.305: C23.1 75.69,16.17 | 75.69,16.17 R36.2 | D15.C 75.69,16.17
BAT_TEMP2
  Top 0.254: R30.2 70.61,12.46 arc-45 70.24,11.57 65.82,7.14 arc45 65.45,6.25 X3.1
D111
  Top 0.203: R104.2 7.16,62.6 arc45 8.06,62.23 9.13,62.23 arc-45 10.02,61.86 16.14,55.74 arc-45 16.51,54.85 16.51,54.76 arc45 16.88,53.86 17.28,53.46 arc45 18.18,53.09 20.87,53.09 arc-90 22.1,51.85 arc90 23.5,50.46 | C112.1 R123.2 29.97,50.46 D111.3 29.97,50.59 R127.2
  Top 0.254: 23.5,50.46 C112.1
DIP-1
  Top 0.152: S1.16 97.16,63.01 arc-45 96.78,62.11 96.38,61.71 arc-45 95.18,61.21 82.69,61.21 arc45 81.8,60.84 81.27,60.32 arc45 80.9,59.42 80.9,59.2 arc-45 80.53,58.3 80.39,58.17 arc90 79.63,57.4 MEGA2560PRO1.D4
DIP-2
  Top 0.152: S1.15 94.61,63.46 arc-45 94.24,62.56 93.7,62.02 arc-45 92.8,61.65 82.24,61.65 arc45 80.26,60.83 79.63,60.2 MEGA2560PRO1.D5
DIP-3
  Top 0.152: S1.14 92.08,63.41 arc-45 91.7,62.51 91.52,62.32 arc-45 90.62,61.95 80.31,61.95 arc40 79.71,61.67 78.73,60.7 arc45 78.36,59.8 78.36,58.69 arc-45 77.99,57.79 MEGA2560PRO1.D6
DIP-4
  Top 0.152: S1.13 89.53,63.54 arc-45 89.16,62.64 89.15,62.63 arc-45 88.25,62.26 80.31,62.26 arc45 77.67,61.16 77.46,60.95 arc45 77.09,60.05 MEGA2560PRO1.D7
DIP-5
  Top 0.152: S1.12 87,63.83 arc-90 85.72,62.56 78.58,62.56 arc45 77.68,62.19 76.19,60.7 arc45 75.82,59.8 75.82,58.69 arc-45 75.45,57.79 MEGA2560PRO1.D8
DIP-6
  Top 0.152: S1.11 84.45,63.87 arc-45 84.19,63.24 arc-45 83.29,62.87 78.38,62.87 arc45 76.39,62.04 74.55,60.2 MEGA2560PRO1.D9
DIP-7
  Top 0.152: S1.10 81.92,64.44 arc-90 80.64,63.17 77.03,63.17 arc45 76.13,62.8 73.78,60.44 arc45 73.41,59.55 73.41,58.44 arc-45 73.03,57.54 72.39,56.9 MEGA2560PRO1.D10
DIP-8
  Top 0.152: S1.9 79.38,64.75 arc-90 78.11,63.48 76.45,63.48 arc45 75.77,63.19 MEGA2560PRO1.D11
ENABLE  (via drill 0.35)
  Top 0.813: v15.88,35.15 15.88,35.53 D14.2
  Top 1.016: D18.C 15.62,28.45 v15.88,28.19
  Bottom 1.016: v15.88,35.15 v15.88,28.19 24.38,28.19 25.89,26.69 25.89,22.43 25.91,22.41 25.91,7.49 24.64,6.22 3.68,6.22 2.54,5.08 X1.1
FEAT_IN1
  Top 0.203: R27.1 42.38,47.33 43.12,47.33 arc45 44.02,47.7 48.13,51.82 49.28,52.97 arc-45 50.18,53.34 66.66,53.34 arc45 67.56,53.71 69.1,55.25 arc45 69.47,56.15 MEGA2560PRO1.D12
FEAT_IN2
  Top 0.203: R127.1 45.16,52.28 46.93,52.28 arc45 47.83,52.66 48.84,53.67 arc-45 49.74,54.04 66.08,54.04 arc45 66.98,54.41 67.83,55.25 arc45 68.2,56.15 68.2,57.64 arc-45 68.57,58.54 MEGA2560PRO1.D13
FEAT_IN3
  Top 0.203: R227.1 27.73,56.52 44.69,56.52 arc-45 45.58,56.14 46.36,55.36 arc45 47.26,54.99 64.5,54.99 arc45 65.4,55.36 MEGA2560PRO1.D14
FEAT_OUT1
  Top 0.203: MEGA2560PRO1.D31 43.42,62.62 arc45 42.53,62.99 36.3,62.99 arc-45 35.4,63.36 R8.2
FEAT_OUT2
  Top 0.203: MEGA2560PRO1.D29 44.2,64.39 R108.2
FEAT_OUT3
  Top 0.254: R208.2 51.32,63.58 arc-45 51.69,62.68 MEGA2560PRO1.D27
FEATURE_IN1
  Top 0.254: X5.6 2.17,66.09 R4.1
FEATURE_IN2
  Top 0.254: X5.5 5.59,72.66 R104.1
FEATURE_IN3
  Top 0.254: X5.4 9.17,66.2 R204.1
FEATURE_OUT1  (1 unrouted)
  Top 0.254: X5.3 12.8,72.74 14.36,74.3 arc-45 15.26,74.68 29.46,74.68 | 29.46,74.68 30.48,74.68 | Q1.4 29.46,73.71 29.46,74.68
FEATURE_OUT2  (1 unrouted)
  Top 0.254: Q101.4 37.53,72 arc-45 36.63,71.63 27.7,71.63 arc-45 26.81,72 25.01,73.8 arc45 24.11,74.17 18.12,74.17 arc45 17.22,73.8 X5.2
FEATURE_OUT3  (1 unrouted)
  Top 0.254: 48.85,73.76 Q201.4 48.9,71.18 arc-45 48.75,71.12 23.13,71.12 arc-45 22.23,71.49 21.35,72.37 arc45 20.46,72.74 X5.1
FET_NTC  (via drill 0.35)
  Top 0.254: v27.18,21.59 19.86,21.59 18.19,21.59
  Top 0.305: TH1.2 15.97,21.6 R24.1 16.3,21.59 18.19,21.59
  Bottom 0.254: v27.18,21.59 84.65,21.59
  Bottom 0.305: MEGA2560PRO1.A0 84.71,21.58 arc-45 84.68,21.57 84.65,21.59
FIELD  (via drill 0.35)
  Top 0.305: 11.3,27.2 C18.2 | Q2.1
  Top 0.406: U4.4 11.3,27.2
  Top 0.508: C18.2 11.53,26.16 v12.57,26.16 Q3.3
  Top 1.016: Q2.1 v6.48,26.16 | Q2.1 Q2.2 Q2.3 | Q3.3 Q3.2 Q3.1 17.98,20.14
  Top 1.27: 17.98,20.14 D19.3 20.59,16.4 19.05,14.86 19.05,7.24 17.14,5.33 14.48,5.33 12.7,3.56 X1.3
  Bottom 1.016: v6.48,26.16 11.43,26.16 v12.57,26.16
  pour Top (isolate 0.406, rank 3): 17.65,21.97 17.65,5.71 23.75,5.71 23.75,21.97
FIELD_PWM  (via drill 0.35)
  Top 0.254: v40.45,46.16 41.08,45.53 59.62,45.53 arc45 62.05,46.54 70.26,54.75 arc-45 71.16,55.12 80.4,55.12 arc45 80.9,55.33 80.9,57.35 arc-45 81.02,57.66 82.17,58.8 MEGA2560PRO1.D3
  Top 0.305: v9.4,33.53 11.3,33.53 U4.5
  Bottom 0.254: v9.4,33.53 13.09,37.22 arc-45 13.99,37.59 32,37.59 40.51,46.1 v40.45,46.16
GND  (via drill 0.35)
  Top 0.203: U5.5 44.03,37.97 C20.2
  Top 0.254: R39.1 4.21,35.98 | U1.7 37.47,27.94 | 37.47,27.94 37.47,24 arc45 37.98,23.79 C1.2 | 37.47,27.94 36.91,27.94 35.98,28.87 35.24,28.87 U1.2 U1.1 | U2.7 66.17,32.77 66.29,32.64 66.29,31.75 66.29,31.24 66.29,30.99 66.29,30.23 C101.2
  Top 0.406: C25.2 4.36,41.27 U3.3 8.38,41.27 | 8.38,41.27 U3.6 | 4.21,35.98 arc45 5.11,36.35 8.01,39.25 arc45 8.38,40.15 8.38,41.27
  other vias: 50.42,22.73 55.5,22.73 25.91,57.78 33.02,54.74 32.13,48.13 47.5,12.32 63.75,41.66 34.54,73.41 45.47,73.41 23.62,72.64 2.03,60.96 5.59,38.35 83.19,35.56 60.07,30.48 39.12,36.2 52.96,33.27 31.11,12.19 27.05,6.35 6.1,55.37 5.08,49.28 1.78,47.12 5.97,34.04 12.57,33.91 55.12,29.59 69.72,30.73 66.29,35.05 60.58,35.05 12.95,30.35 21.72,29.46 25.15,48.77 43.69,22.86 87.76,27.43 88.01,34.04 54.99,44.2 97.41,2.16
  pour Bottom (isolate 0.406, rank 5): -0.38,-0.25 101.73,-0.25 101.73,76.58 -0.38,76.58
  pour Top (isolate 0.305, rank 3): -1.02,77.47 -1.02,-0.51 100.2,-0.51 100.2,79.38 arc166 2.47,91.41
LED_GREEN
  Top 0.254: R42.1 97.92,31.07 arc45 97.8,31.36 92.32,36.84 arc45 91.42,37.21 83.46,37.21 arc45 82.56,36.84 79.24,33.52 arc45 77.09,28.33 MEGA2560PRO1.A7
LED_GREEN2
  Top 0.254: MEGA2560PRO1.A3 83.02,27.27 arc-45 85.87,28.45 90.24,28.45 arc-45 92.87,27.36 R142.1
LED_GREEN_EXT
  Top 0.254: X3.7 86.45,4.42 arc-45 86.82,5.32 D10.C 91.84,8.54 arc45 92.74,8.92 94.75,10.93 arc45 95.12,11.83 95.12,14.97 arc45 94.75,15.87 94.48,16.14 arc-45 94.11,17.04 R142.2
LED_RED
  Top 0.254: R40.1 95.63,31.35 arc45 95.26,32.25 92.07,35.44 arc45 91.17,35.81 85.23,35.81 arc45 84.34,35.44 81.78,32.88 arc45 79.63,27.69 MEGA2560PRO1.A5
LED_RED2
  Top 0.254: MEGA2560PRO1.A1 91.15,26.42 R140.1
LED_RED_EXT
  Top 0.254: X3.5 79.45,5.5 arc-45 79.82,6.39 82.61,9.19 arc-45 83.51,9.56 86.74,9.56 | 86.74,9.56 D8.C | 86.74,9.56 86.74,12.05 arc-45 87.11,12.95 87.64,13.47 arc45 88.01,14.37 88.01,16.11 arc-45 88.38,17.01 88.66,17.28 arc-45 89.55,17.65 arc45 90.17,17.91 91.07,18.8 arc45 91.44,19.7 R140.2
N$1
  Top 0.254: U2.10 67.8,34.27 R102.1
  Top 0.406: R102.1 67.94,36.34 C102.1
N$2
  Top 0.254: U2.9 63.63,33.78 63.63,34.36 arc-45 64,35.26 65.32,36.58 C102.2 66.94,37.94 arc-45 67.84,38.31 R109.1
N$3
  Top 0.152: R2.1 41.45,29.44
  Top 0.305: 41.45,29.44 U1.10 | C2.1 42.25,30.04 R2.1
N$4
  Top 0.152: 44.2,33.45 R9.1
  Top 0.305: 44.2,33.45 42.26,33.45 arc45 41.81,33.26 C2.2 38.73,30.18 arc45 38.35,29.28 38.35,28.96 U1.9
N$5
  Top 0.254: U2.8 63.25,33.27 63.12,33.4 C104.1 62.98,36.51 57.1,36.51 arc45 56.2,36.13 56.12,36.06 arc45 55.75,35.16 R101.1 55.55,33.96 52.96,31.37 52.96,18.64 arc45 53.84,16.52 D104.C
N$6
  Top 0.508: D17.1 8.13,27.69 | C18.1 9.02,26.8 8.13,27.69 | 8.13,27.69 8.39,27.95 arc45 8.76,28.85 U4.2
N$7
  Top 0.203: R4.2 4.49,61.97 arc45 5.39,61.59 9,61.59 arc-45 9.9,61.22 15.78,55.34 arc-45 16.15,54.44 16.15,54 arc90 17.42,52.73 20.47,52.73 arc-90 21.74,51.46 21.74,50.91 21.97,50.68 21.97,48.25 arc45 22.32,47.4 arc45 23.22,47.03 23.75,47.03 23.62,46.9 C12.1 R23.2 27.26,46.19 arc45 28.59,45.64 D11.3 R27.2
N$8
  Top 0.254: 8.76,32.09 arc-90 10.03,30.82 U4.3
  Top 0.305: R29.1 8.76,32.09 | U4.3 R26.1
N$9
  Top 0.203: R204.2 16.65,56.93 arc-45 17.02,56.03 17.02,55.82 arc45 17.24,55.27 | C212.1 R223.2 23.12,54.14 D211.3 26.55,53.64 R227.2
  Top 0.305: C212.1 18.16,54.36 17.24,55.27
N$10
  Top 0.203: R8.1 30.88,64.26 29.36,64.26 arc-45 28.46,64.63 27.78,65.31 arc-45 27.41,66.21 Q1.1
N$11
  Top 0.61: R29.2 1.78,29.72 1.4,29.34 1.4,21.41 Q2.4
N$12
  Top 0.406: U4.8 7.27,34.89 R19.1
N$13
  Top 0.61: R26.2 11.3,23.41 Q3.4
N$14
  Top 0.254: R7.1 29.72,15.15 C11.1 32.27,19.23 arc45 32.77,20.43 32.77,37.37 arc-45 33.01,37.96 35.31,40.27 arc-45 36.21,40.64 36.75,40.64 U5.2
N$15
  Top 0.508: R31.1 36.88,43.91 U5.1
N$16
  Top 0.254: Q101.1 36.93,67.06 arc90 39.6,64.39 R108.1
N$17
  Top 0.254: R1.1 33.77,18.74
  Top 0.305: U1.8 38.61,28.45 arc-90 37.34,29.72 C4.1 35.11,31.66 arc45 34.21,31.29 33.77,30.85 arc45 33.27,29.65 33.27,19.94 arc45 33.77,18.74 | R1.1 37.52,18.09 arc-45 38.41,17.72 D4.C
N$18
  Top 0.254: Q201.1 46.58,66.61 R208.1
N$19
  Top 0.61: 12.57,42.55 U3.7 | 14.22,40.89 13.97,41.15 | U3.5 12.83,40.01
  Top 0.813: 14.22,40.89 17.53,37.59 17.65,37.47 22.61,32.51 C31.1 | 12.57,42.55 13.97,41.15 12.83,40.01
  Top 1.27: D14.1 17.65,37.47
N$20
  Top 0.406: U3.2 4.79,42.55 C25.1
N$21
  Top 0.254: U3.1 6.18,45.89 C27.1
N$22
  Top 0.254: C27.2 10.88,44.07 10.92,44.07 11.18,43.81 U3.8
  Top 0.406: L1.4 L1.1 11.23,45.74 arc-45 11.6,44.84 U3.8
  Top 0.61: C29.1 13.76,44.07 | 13.76,44.07 10.92,44.07 | D20.1 15.05,44.84 arc45 14.15,44.47 13.76,44.07
N$23
  Top 0.254: MEGA2560PRO1.TX 83.81,58.54 arc45 83.44,57.64 83.44,53.74 arc45 83.81,52.84 84.21,52.44 arc45 85.11,52.07 arc45 85.73,52.33 85.99,52.59 arc45 86.36,53.48 D7.C
N$24
  Top 0.61: R41.2 18.12,41.4 C29.2
N$25
  Top 0.254: R40.2 95.63,11.32 arc-45 95.26,10.42 93.3,8.47 arc45 92.93,7.57 RED.2 91.44,4.73 LED1.1
N$26
  Top 0.254: R42.2 97.92,6.11 arc-45 97.55,5.22 LED1.3 95.62,3.29 arc-45 94.72,2.92 93.95,2.92 arc90 GREEN.2
N$27
  Top 0.406: R39.2 R43.1 1.82,40.01 U3.4
N$28
  Top 0.254: MEGA2560PRO1.RX 84.71,56.52 84.45,56.25 arc45 84.07,55.35 84.07,55.17 arc45 84.45,54.27 D5.C
N$49  (via drill 0.35)
  other vias: 27.18,70.1
N$50  (via drill 0.35)
  other vias: 28.7,70.1
N$51  (via drill 0.35)
  other vias: 30.73,70.1
N$52  (via drill 0.35)
  other vias: 32.26,70.1
N$53  (via drill 0.35)
  other vias: 36.83,70.1
N$54  (via drill 0.35)
  other vias: 39.24,70.1
N$55  (via drill 0.35)
  other vias: 41.27,70.1
N$56  (via drill 0.35)
  other vias: 43.94,67.31
N$57  (via drill 0.35)
  other vias: 46.61,69.98
N$58  (via drill 0.35)
  other vias: 48.9,70.1
N$59  (via drill 0.35)
  other vias: 51.05,70.1
N$60  (via drill 0.35)
  other vias: 53.34,67.56
RX-1
  Top 0.152: D106.C 62.77,62.55 | D106.C 62.83,60.94 arc-45 62.46,60.05 MEGA2560PRO1.D19 | D106.C 62.77,62.55 | 62.77,62.55 X4.4
RX-2
  Top 0.152: MEGA2560PRO1.D17 66.14,61.19 arc-45 66.82,61.47 69.67,61.47 arc45 70.35,61.75 D6.C 72.98,64.38 arc45 73.27,65.06 X4.1
SCL  (via drill 0.35)
  Top 0.203: R35.1 58.42,32.3 60.54,32.3 U2.5 | U1.5 v35.15,26.19 35.18,26.16
  Top 0.254: IC2-1.3 24.52,61.48 arc-45 25.42,61.85 34.78,61.85 arc-45 35.68,61.48 I2C-2.3 | 35.18,26.16 v35.15,26.19 | v58.29,30.73 58.29,32.17 58.42,32.3
  Bottom 0.203: v35.15,26.19 41.28,26.19 arc45 42.18,26.56 45.08,29.46 arc-45 46.93,30.23 57.26,30.23 arc45 58.16,30.6 v58.29,30.73
  Bottom 0.254: 60.58,59.63 60.58,41.17 arc-45 60.21,40.27 58.66,38.73 arc45 58.29,37.83 v58.29,30.73 | 60.58,59.63 59.12,59.63 56.52,62.23 39.77,62.23 arc45 38.87,61.86 I2C-2.3 | 60.58,59.63 59.5,59.63 MEGA2560PRO1.D21
SDA  (via drill 0.35)
  Top 0.203: U1.4 35.06,27.85 34.34,27.85 33.78,27.3 33.78,26.41 arc45 34.41,24.9 v34.67,24.64
  Top 0.254: v58.29,39.75 R37.1 59.52,37.43 v59.56,37.47 | U2.4 61.24,32.77 arc-45 61.85,32.51 v61.85,30.86
  Bottom 0.203: v34.67,24.64 41.07,24.64 arc45 43.81,25.77 45.35,27.31 arc-45 46.25,27.69 50.65,27.69 arc45 53.08,28.69 arc-45 53.71,28.96 59.75,28.96 arc45 60.52,29.27 61.85,30.61 v61.85,30.86
  Bottom 0.254: v58.29,39.75 58.94,40.4 arc45 59.31,41.29 MEGA2560PRO1.D20 59.18,56.77 59.18,54.74 58.79,54.35 arc-45 57.89,53.98 41.17,53.98 arc-45 40.27,54.35 I2C-2.4 33.39,58.92 arc-45 32.49,58.55 22.62,58.55 arc-45 21.73,58.92 IC2-1.4 | v61.85,30.86 61.85,34.78 arc45 61.48,35.68 59.69,37.47 v59.56,37.47
STATOR
  Top 0.508: R7.2 27.34,14.35 26.91,13.92 arc45 26.54,13.02 26.54,9.04 arc-45 25.11,5.58 X1.5
STATOR_IRQ
  Top 0.254: U5.7 40.15,40.51 arc-45 39.25,40.88 arc45 38.62,41.15 | 10.03,35.92 10.03,36.18 arc-45 10.4,37.08 arc-45 10.73,37.21 11.43,37.21 arc-90 12.7,35.94 12.7,35.56 arc90 13.97,34.29 18.52,34.29 arc-45 19.42,33.92 21.47,31.87 arc45 22.98,31.24 27.05,31.24 arc90 28.32,32.51 28.32,33.64 arc-45 28.69,34.53 34.93,40.78 arc-45 35.83,41.15 38.62,41.15 | 38.62,41.15 40.4,42.93 59.67,42.93 arc45 60.57,43.3 70.75,53.48 arc-45 71.65,53.85 80.5,53.85 arc45 81.4,54.22 81.8,54.62 arc45 82.17,55.52 MEGA2560PRO1.D2
  Top 0.305: U4.6 10.03,35.92
TACH_OUT
  Top 0.254: R19.2 5.53,33.19 arc-45 6.43,32.81 arc45 6.54,32.77 19.29,32.77 arc-45 20.18,32.39 27.82,24.76 arc-45 28.19,23.86 28.19,3.58 X1.6
TX-1
  Top 0.152: X4.6 57.38,71.39 arc-45 57.75,70.49 D109.C 59.18,62.48 arc-90 60.58,61.09 60.58,58.69 arc45 60.95,57.79 MEGA2560PRO1.D18
TX-2
  Top 0.152: MEGA2560PRO1.D16 64.26,56.9 63.49,57.67 arc-45 63.12,58.56 63.12,59.55 arc-45 63.49,60.44 64.63,61.58 arc-45 64.97,61.72 arc45 66.3,62.27 D9.C 66.27,62.73 X4.3
VDD  (via drill 0.35)
  Top 0.406: L1.3 L1.2 11.82,50.15 arc-45 12.19,49.25 12.19,48.79 C32.1
  Top 0.508: 8.47,57.49 7.98,57.49 arc-45 7.08,57.87 5.5,59.45 arc75 3.97,59.65 2.41,58.74 arc60 2.03,58.09 2.03,50.29 v2.79,49.53 2.79,43.29 arc-45 2.42,42.39 R43.2 | v12.7,31.88 16.44,31.88 arc-45 19.16,30.75 23.11,26.06 TP-VDD.TP | D17.2 3.3,27.69 3.95,28.33 arc45 4.32,29.23 v4.32,30.1 7.31,30.1 U4.1
  Top 0.61: L1.3 8.98,56.99 | 8.47,57.49 8.98,56.99 | 8.98,56.99 9.88,56.09 arc45 10.78,55.71 C30.1
  Bottom 0.508: v2.79,49.53 3.29,46.63 arc35 3.64,45.94 3.95,45.64 arc-45 4.32,44.74 4.32,31.88 | v4.32,30.1 4.32,31.75 4.32,31.88 | v12.7,31.88 4.32,31.88
  Bottom 0.813: L1.3 16,64.78 arc-45 16.9,65.15 73.9,65.15 arc-45 74.79,64.78 76.21,63.36 arc45 77.11,62.99 87.12,62.99 97.41,62.99 MEGA2560PRO1.VIN@1 MEGA2560PRO1.VIN@2

### Text on the board
tNames: FI1 | FI2 | FI3 | FO1 | FO2 | FO3 | TX1 | GND | RX1 | TX2 | GND | RX2 | X1 | SDA | SCL | GND | +5V | * | * | * | * | 8 7 6 5 4 3 2 1 | SCL | GND | +5V | SDA | * | * | + | ARDUINO MEGA 2560 PRO EMBED | ALTERNATOR CONTROLLER | * | * | Pete Dubler (c) July 2021 | Rev 1.206C 12V and 24V | * | * | * | + | * | * | RESET | * | * | * | * | * | * | * | * | * | * | * | * | * | * | * | X3 | LEDS | ENABLE | ALT+ | FIELD | ALT- | STATOR | STATOR | TACH | BAT+ | BAT- | BSH+ | BSH- | ASH+ | ASH- | BAT TEMP | ALT TEMP | RED GND GRN | * | * | * | *
bNames: ARDUINO MEGA 2560 PRO EMBED | ALTERNATOR CONTROLLER | Pete Dubler (c) July 2021 | Rev 1.206C 12V and 24V
tDocu: * | * | *